# Altium schematic sheet Schematic_v1.SchDoc
size A; SheetNumber: 1; SheetTotal: 1
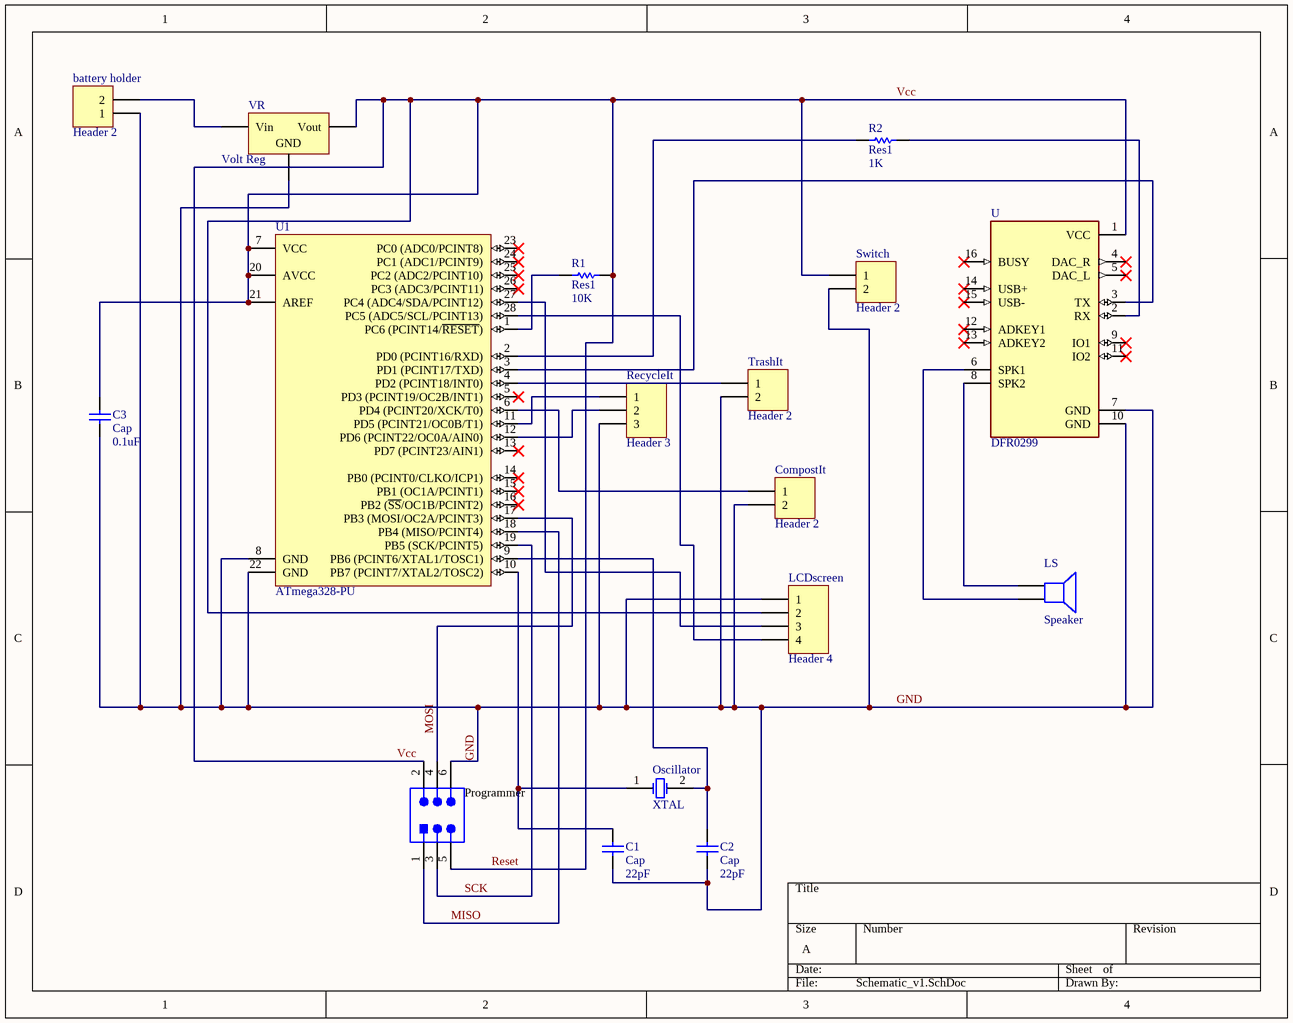
[diagram p0: Schematic_v1.SchDoc]

## Parts
battery_holder  Header 2  [HDR1X2]
C1  Cap  value 22pF  [RAD-0.3]
C2  Cap  value 22pF  [RAD-0.3]
C3  Cap  value 0.1uF  [RAD-0.3]
CompostIt  Header 2  [HDR1X2]
LCDscreen  Header 4  [HDR1X4]
LS  Speaker  [PIN2]
Oscillator  XTAL  [R38]
Programmer  TSW-103-08-L-D  [SMTC-TSW-103-08-L-D_V]  (value not drawn)
R1  Res1  value 10K  [AXIAL-0.3]
R2  Res1  value 1K  [AXIAL-0.3]
RecycleIt  Header 3  [HDR1X3]
Switch  Header 2  [HDR1X2]
TrashIt  Header 2  [HDR1X2]
U  DFR0299  [MODULE_DFR0299]
U1  ATmega328-PU  [28P3]
VR  Volt Reg  [D2PAK_N]

## Nets
GND: battery_holder.1 C1.1 C2.1 C3.1 CompostIt.2 LCDscreen.1 Programmer.6 RecycleIt.3 Switch.2 TrashIt.2 U.7(GND) U.10(GND) U1.8(GND) U1.22(GND) VR.2(GND)
MISO: Programmer.1 U1.18(PB4_(MISO/PCINT4))
MOSI: Programmer.4 U1.17(PB3_(MOSI/OC2A/PCINT3))
Reset: C3.2 LCDscreen.2 Programmer.2 Programmer.5 R1.2 Switch.1 U.1(VCC) U1.7(VCC) U1.20(AVCC) U1.21(AREF) VR.3(Vout)  [also labelled Vcc]
SCK: Programmer.3 U1.19(PB5_(SCK/PCINT5))
Netbattery_holder_2: battery_holder.2 VR.1(Vin)
NetC1_2: C1.2 Oscillator.1(OSC1) U1.10(PB7_(PCINT7/XTAL2/TOSC2))
NetC2_2: C2.2 Oscillator.2(OSC2) U1.9(PB6_(PCINT6/XTAL1/TOSC1))
NetCompostIt_1: CompostIt.1 U1.6(PD4_(PCINT20/XCK/T0))
NetLCDscreen_3: LCDscreen.3 U1.27(PC4_(ADC4/SDA/PCINT12))
NetLCDscreen_4: LCDscreen.4 U1.28(PC5_(ADC5/SCL/PCINT13))
NetLS_1: LS.1 U.8(SPK2)
NetLS_2: LS.2 U.6(SPK1)
NetR1_1: R1.1 U1.1(PC6_(PCINT14/~{RESET}))
NetR2_1: R2.1 U1.2(PD0_(PCINT16/RXD))
NetR2_2: R2.2 U.2(RX)
NetRecycleIt_1: RecycleIt.1 U1.11(PD5_(PCINT21/OC0B/T1))
NetRecycleIt_2: RecycleIt.2 U1.12(PD6_(PCINT22/OC0A/AIN0))
NetTrashIt_1: TrashIt.1 U1.4(PD2_(PCINT18/INT0))
NetU_3: U.3(TX) U1.3(PD1_(PCINT17/TXD))

Not connected (* = marked no-connect by the designer): U 4(DAC_R)* 5(DAC_L)* 9(IO1)* 11(IO2)* 12(ADKEY1)* 13(ADKEY2)* 14(USB+)* 15(USB-)* 16(BUSY)*; U1 5(PD3_(PCINT19/OC2B/INT1))* 13(PD7_(PCINT23/AIN1))* 14(PB0_(PCINT0/CLKO/ICP1))* 15(PB1_(OC1A/PCINT1))* 16(PB2_(~{SS}/OC1B/PCINT2))* 23(PC0_(ADC0/PCINT8))* 24(PC1_(ADC1/PCINT9))* 25(PC2_(ADC2/PCINT10))* 26(PC3_(ADC3/PCINT11))*

## Library data of the parts
battery_holder CompostIt Switch TrashIt = Header 2: Header, 2-Pin; LatestRevisionDate: 17-Jul-2002; LatestRevisionNote: Re-released for DXP Platform.; Publisher: Altium Limited
C1-C3 = Cap: Capacitor; Published: 8-Jun-2000; LatestRevisionDate: 17-Jul-2002; LatestRevisionNote: Re-released for DXP Platform.; PackageReference: RAD-0.3; Publisher: Altium Limited; PackageDescription: Radial Cap, Thru-Hole; 2 Leads; 0.3 in Pin Spacing
LCDscreen = Header 4: Header, 4-Pin; LatestRevisionDate: 17-Jul-2002; LatestRevisionNote: Re-released for DXP Platform.; Publisher: Altium Limited
LS = Speaker: Loudspeaker; Published: 24-Mar-1999; LatestRevisionDate: 17-Jul-2002; LatestRevisionNote: Re-released for DXP Platform.; PackageReference: PIN2; Publisher: Altium Limited
Oscillator = XTAL: Crystal Oscillator; Published: 8-Jun-2000; LatestRevisionDate: 17-Jul-2002; LatestRevisionNote: Re-released for DXP Platform.; PackageReference: R38; Publisher: Altium Limited; PackageDescription: Crystal, Thru-Hole; 2 Leads; Body 3.1 x 8.2 mm (Dia.xH)
Programmer = CMP-1024-00336-5: Male Header, Pitch 2.54 mm, 2 x 3 Position, Height 8.38 mm, Tail Length 5.08 mm, -55 to 125 degC, RoHS, Bulk; Manufacturer: Samtec; DatasheetVersion: 04/2012; ComponentLink3URL: http://suddendocs.samtec.com/prints/tsw-xxx-xx-x-x-xx-xxx-footprint.pdf; PackageReference: TSW-103-08-L-D; Mounting Technology: Through Hole; Min Operating Temperature: -55 degC; ComponentLink2Description: Datasheet; Lead Pitch: 2.54 mm; ComponentLink1Description: Manufacturer URL; Mount: Through Hole; ComponentLink1URL: http://www.samtec.com/; ComponentLink3Description: Package Specification; Max Operating Temperature: 125 degC; PackageDescription: Male Header, Pitch 2.54 mm, 2 x 3 Position, Height 8.38 mm, Tail Length 5.08 mm; ComponentLink2URL: https://datasheet.ciiva.com/25618/0900766b81154476-25618436.pdf; RoHSCompliant: true
R1 R2 = Res1: Resistor; Published: 8-Jun-2000; LatestRevisionDate: 17-Jul-2002; LatestRevisionNote: Re-released for DXP Platform.; PackageReference: AXIAL-0.3; Publisher: Altium Limited; PackageDescription: Axial Device, Thru-Hole; 2 Leads; 0.3 in Pin Spacing
RecycleIt = Header 3: Header, 3-Pin; LatestRevisionDate: 17-Jul-2002; LatestRevisionNote: Re-released for DXP Platform.; Publisher: Altium Limited
U = DFR0299: MP3 Player Audio Arduino Platform Evaluation Expansion Board; MF: DFRobot; MP: DFR0299; Availability: Unavailable; Package: None; Value: *; Price: None; SnapEDA_Link: https://www.snapeda.com/parts/DFR0299/DFRobot/view-part/588059/?ref=snap
U1 = CMP-0095-00015-2: 8-bit AVR Microcontroller, 32KB Flash, 1KB EEPROM, 2KB SRAM, 28-pin PDIP, Industrial Grade (-40°C to 85°C); ComponentLink3Description: ATmega48A/48PA/88A/88PA/168A/168PA/328/328P Summary; RevisionNote: DatasheetVersion updated. URLs added.; DatasheetVersion: revD, May-2011; ComponentLink1URL: http://www.atmel.com/; PackageVersion: revB, Sep-2001; PackageDescription: 28-lead (0.300"/7.62mm Wide) Plastic Dual Inline Package (PDIP); PackageReference: 28P3; ComponentLink1Description: Manufacturer URL; ComponentLink2Description: ATmega48A/48PA/88A/88PA/168A/168PA/328/328P Datasheet; ComponentLink3URL: http://www.atmel.com/dyn/resources/prod_documents/8271S.pdf; ComponentLink2URL: http://www.atmel.com/dyn/resources/prod_documents/8271.pdf
VR = Volt Reg: Voltage Regulator; Published: 24-Mar-1999; LatestRevisionDate: 29-May-2009; LatestRevisionNote: IPC-7351 Footprint Added.; PackageReference: D2PAK; Publisher: Altium Limited; PackageDescription: 3-Pin Transistor Outline Package 2.54 mm Pitch, 15.1 mm Lead Span